# EAGLE design LED-single-sided-front (EAGLE 8.2.2)
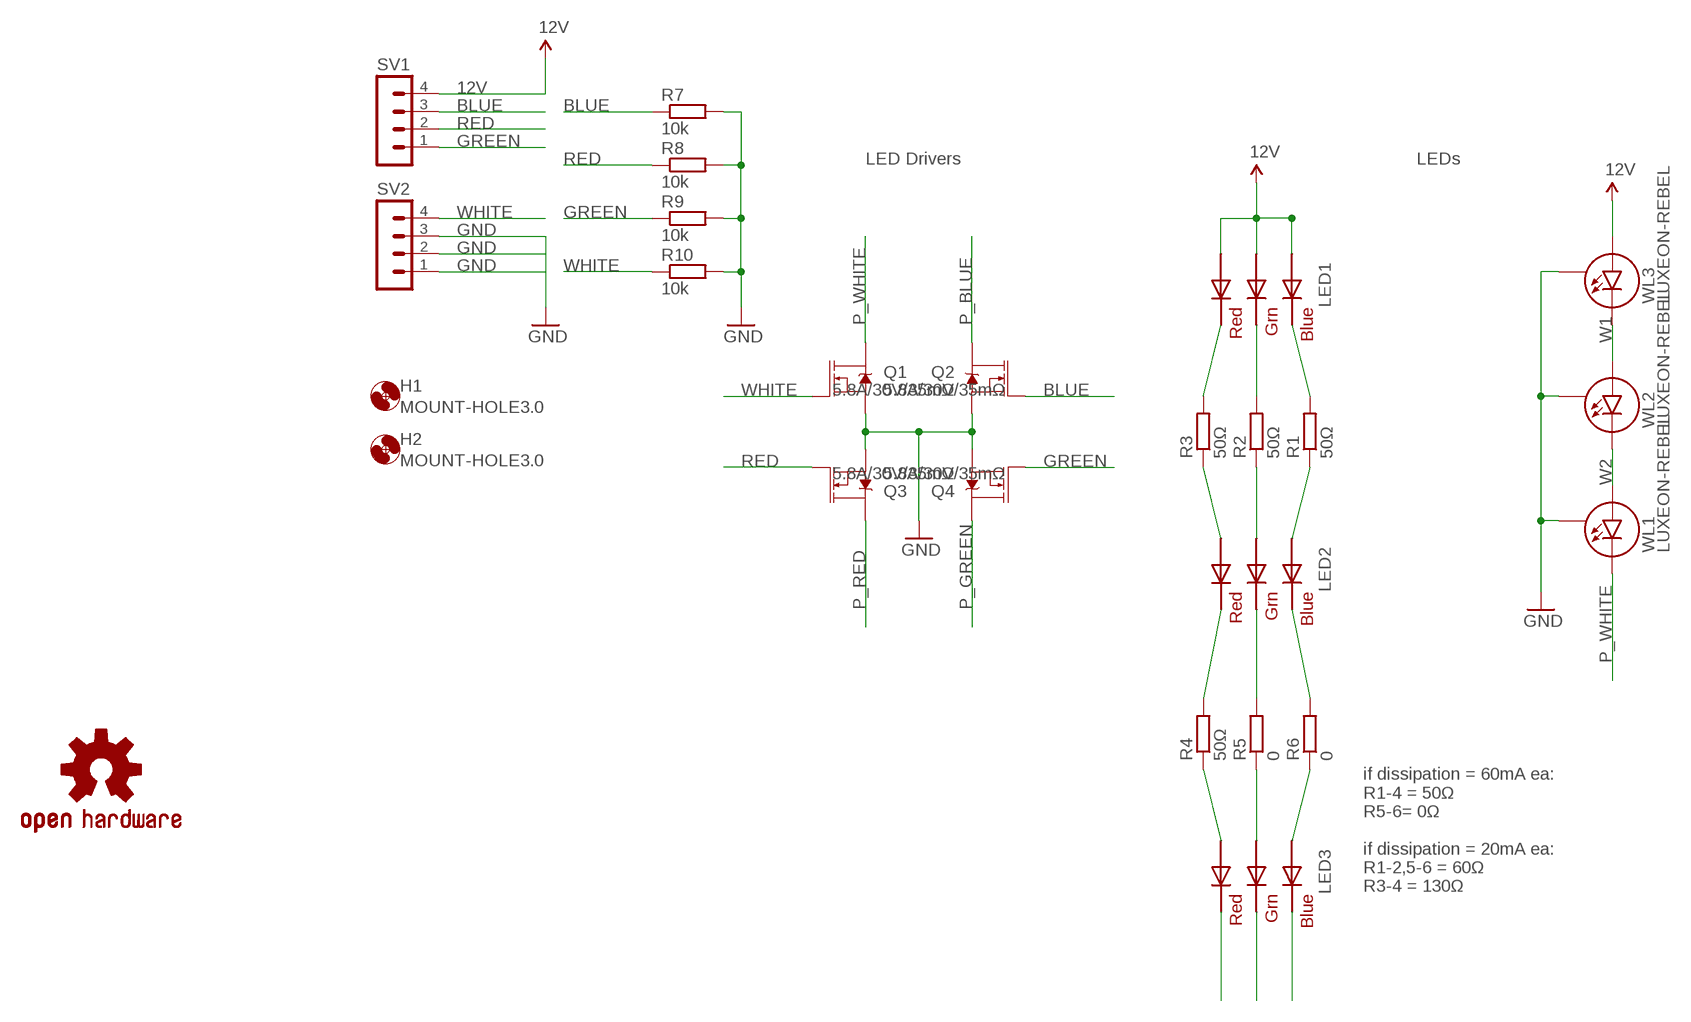
[diagram p0: schematic, sheet 1]

## Parts
H1  MOUNT-HOLE3.0  [3,0]
H2  MOUNT-HOLE3.0  [3,0]
LED1  RGBLED5050  [RGBLED5050]
LED2  RGBLED5050  [RGBLED5050]
LED3  RGBLED5050  [RGBLED5050]
LOGO1  OSHW-LOGOS  [OSHW-LOGO-S]
Q1  5.8A/30V/35mΩ  MOSFET-NCH-AO3404A  [SOT23-3]
Q2  5.8A/30V/35mΩ  MOSFET-NCH-AO3404A  [SOT23-3]
Q3  5.8A/30V/35mΩ  MOSFET-NCH-AO3404A  [SOT23-3]
Q4  5.8A/30V/35mΩ  MOSFET-NCH-AO3404A  [SOT23-3]
R1  50Ω  R-EU_R1206  [R1206]
R2  50Ω  R-EU_R1206  [R1206]
R3  50Ω  R-EU_R1206  [R1206]
R4  50Ω  R-EU_R1206  [R1206]
R5  0  R-EU_R1206  [R1206]
R6  0  R-EU_R1206  [R1206]
R7  10k  R-EU_R1206  [R1206]
R8  10k  R-EU_R1206  [R1206]
R9  10k  R-EU_R1206  [R1206]
R10  10k  R-EU_R1206  [R1206]
SV1  MA04-1  [MA04-1]
SV2  MA04-1  [MA04-1]
WL1  LUXEON-REBEL  [LUXEON-REBEL]
WL2  LUXEON-REBEL  [LUXEON-REBEL]
WL3  LUXEON-REBEL  [LUXEON-REBEL]

## Nets
12V: LED1.1(GREEN_A) LED1.2(RED_A) LED1.3(BLUE_A) SV1.4 WL3.ANODE(A)
BLUE: Q2.1(G) R7.1 SV1.3
GND: Q1.2(S) Q2.2(S) Q3.2(S) Q4.2(S) R7.2 R8.2 R9.2 R10.2 SV2.1 SV2.2 SV2.3 WL1.P$3(S) WL2.P$3(S) WL3.P$3(S)
GREEN: Q4.1(G) R9.1 SV1.1
N$1: LED1.5(RED_C) R3.2
N$2: LED1.6(GREEN_C) R2.2
N$3: LED1.4(BLUE_C) R1.2
N$4: LED3.2(RED_A) R4.1
N$5: LED3.1(GREEN_A) R5.1
N$6: LED3.3(BLUE_A) R6.1
N$30: LED2.5(RED_C) R4.2
N$31: LED2.6(GREEN_C) R5.2
N$32: LED2.4(BLUE_C) R6.2
N$33: LED2.2(RED_A) R3.1
N$34: LED2.1(GREEN_A) R2.1
N$35: LED2.3(BLUE_A) R1.1
P_BLUE: LED3.4(BLUE_C) Q2.3(D)
P_GREEN: LED3.6(GREEN_C) Q4.3(D)
P_RED: LED3.5(RED_C) Q3.3(D)
P_WHITE: Q1.3(D) WL1.CATHODE(C)
RED: Q3.1(G) R8.1 SV1.2
W1: WL2.ANODE(A) WL3.CATHODE(C)
W2: WL1.ANODE(A) WL2.CATHODE(C)
WHITE: Q1.1(G) R10.1 SV2.4

## Notes on the sheet
- LED Drivers | LEDs
- if dissipation = 60mA ea:
  R1-4 = 50Ω
  R5-6= 0Ω
  
  if dissipation = 20mA ea:
  R1-2,5-6 = 60Ω
  R3-4 = 130Ω

## Library data of the parts
H1 H2 = holes:MOUNT-HOLE: MOUNTING HOLE with drill center marker
LED1-LED3 = adafruit:RGBLED: For 5050 RGB LEDs, the order of the LEDs may vary from one manufacturer to another!
LOGO1 = SparkFun-Aesthetics:OSHW-LOGO: Open Source Hardware Logo This logo indicates the piece of hardware it is found on incorporates a OSHW license and/or adheres to the definition of open source hardware found here: http://freedomdefined.org/OSHW
Q1-Q4 = SparkFun-DiscreteSemi:MOSFET-NCH: N-channel MOSFETs Voltage controlled devices that allow control of high current outputs. SparkFun Products: SparkFun OpenScale <https://www.sparkfun.com/products/13261> SparkFun Digital Sandbox <https://www.sparkfun.com/products/12651> SparkFun Monster Moto Shield <https://www.sparkfun.com/products/10182> SparkFun MOSFET Power Controller <https://www.sparkfun.com/products/11214>; PROD_ID: TRANS-12988
R1-R10 = rcl:R-EU_: RESISTOR, European symbol
SV1 SV2 = con-lstb:MA04-1: PIN HEADER; OC_FARNELL: unknown; OC_NEWARK: unknown
WL1-WL3 = SparkFun-LED:LUXEON-REBEL: Luxeon Rebel single-color high output LED

## Board
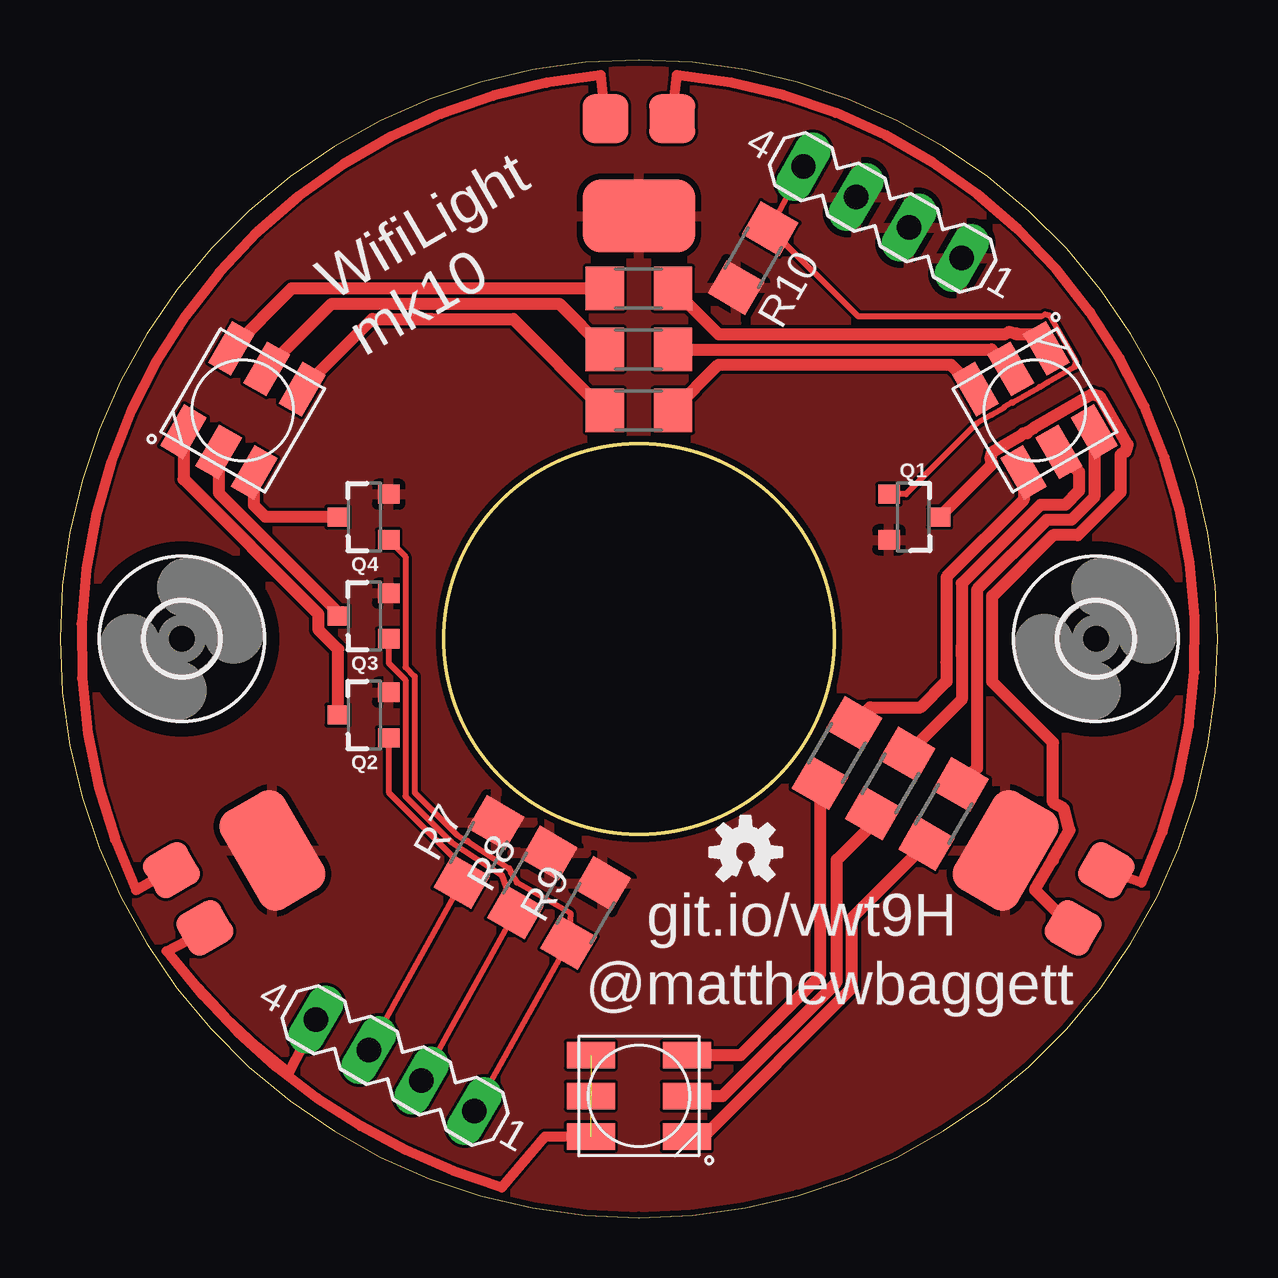
[diagram p1: board, top side]

Size 48.26 x 48.26 mm. Coordinates in mm from the lower left corner, seen from the top.
Outline: 24.13,0 arc90 48.26,24.13 arc90 24.13,48.26 arc90 0,24.13 arc90 24.13,0
Outline: circle at 24.13,24.13 radius 8.13
Copper layers (1*16): Top 0.035mm / dielectric 1.5mm / Bottom 0.035mm
Design rules "dirtypcbs": minimum track width 5mil, minimum drill 12mil, track to track 5mil, track to pad 5mil, pad to pad 5mil, via to via 5mil, smd to smd 0mil, copper to edge 10mil, drill to drill 10mil, minimum pad ring 10mil, minimum via ring 6mil, stop-mask expansion 2mil, vias tented up to drill 25mil, thermal gap 10mil

### Footprints (pad centres in the part's own frame; a part is rotated, then mirrored left to right if it is on the bottom)
3,0 = hole 3: 0,0
RGBLED5050 = smd 2 x 1.1: 1 -2,1.7; 2 -2,0; 3 -2,-1.7; 4 2,-1.7; 5 2,0; 6 2,1.7
SOT23-3 = smd 0.8 x 0.9: 1 -0.95,-1; 2 0.95,-1; 3 0,1.1
R1206 = smd 1.6 x 1.803: 1 -1.422,0; 2 1.422,0
MA04-1 = drill 1.016 long: 1 -3.81,0; 2 -1.27,0; 3 1.27,0; 4 3.81,0
LUXEON-REBEL = smd 1.91 x 2.03: ANODE -1.39,2.63; CATHODE 1.39,2.63 | smd 4.68 x 3.03: P$3 0,-1.42

### Placement (x,y rotation side)
H1  43.18,24.13 0 top
H2  5.08,24.13 0 top
LED1  24.13,5.08 0 top
LED2  40.64,33.66 120 top
LED3  7.62,33.66 240 top
LOGO1  28.57,15.24 0 top
Q1  35.56,29.21 270 top
Q2  12.7,20.95 90 top
Q3  12.7,25.08 90 top
Q4  12.7,29.21 90 top
R1  36.83,16.83 240 top
R2  32.38,19.37 240 top
R3  34.61,18.1 240 top
R4  24.13,36.2 0 top
R5  24.13,33.66 0 top
R6  24.13,38.73 0 top
R7  17.46,15.24 60 top
R8  19.68,13.97 60 top
R9  21.91,12.7 60 top
R10  28.89,40.01 240 top
SV1  13.97,6.35 150 top
SV2  34.29,41.91 150 top
WL1  40.64,14.61 240 top
WL2  24.13,43.18 0 top
WL3  7.62,14.61 120 top

### Tracks (layer width: path | path; a pad name or v marks a point on that pad's centre or on a via)
12V  (2 unrouted)
  Top 0.406: 4.6,10.95 4.45,11.11 5.71,11.76 WL3.ANODE | LED1.3 20.21,3.38 18.41,1.27 arc-37 4.6,10.95 | SV1.4 9.53,6.03 arc-15 4.6,10.95
BLUE
  Top 0.254: Q2.1 13.7,17.73 16.51,14.92 16.51,14.25 R7.1 SV1.3
GND
  pour Top: 0,24.13 arc90 24.13,0 arc90 48.26,24.13 arc90 24.13,48.26 arc90
GREEN
  Top 0.254: Q4.1 14.4,27.56 14.4,22.95 14.79,22.57 14.79,17.73 16.55,15.96 16.93,15.71 16.99,15.71 17.04,15.66 18.72,14.56 18.73,14.54 18.76,14.52 18.78,14.39 19.05,13.97 21.27,12.7 R9.1 SV1.1
N$1
  Top 0.508: LED1.5 27.62,5.08 32.38,9.84 32.38,14.92 33.9,16.43 R3.2
N$2
  Top 0.508: LED1.6 28.37,6.78 31.67,10.08 R2.2
N$3
  Top 0.508: LED1.4 26.82,3.38 33.02,9.58 33.02,12.5 R1.2
N$4
  Top 0.508: R4.1 20.8,38.1 11.33,38.1 LED3.2
N$5
  Top 0.508: R5.1 18.9,37.47 15.5,37.47 | 15.5,37.47 15.24,37.47 | LED3.1 13.02,37.47 15.5,37.47
N$6
  Top 0.508: R6.1 9.65,38.73 LED3.3
N$30
  Top 0.508: R4.2 38.83,36.2 LED2.5
N$31
  Top 0.508: R5.2 27.46,35.56 37.15,35.56 LED2.6
N$32
  Top 0.508: R6.2 27.46,36.83 39.38,36.83 39.56,36.94 39.87,36.85 39.88,36.83 40.52,36.83 LED2.4
N$33
  Top 0.508: R3.1 37.59,21.6 37.59,23.44 | 37.59,23.44 37.59,23.81 | LED2.2 42.48,31.09 42.48,30.3 41.89,29.72 40.87,29.72 37.59,26.45 37.59,23.44
N$34
  Top 0.508: R2.1 33.77,21.27 35.88,21.27 36.96,22.35 36.96,23.12 | 36.96,23.12 36.96,23.18 | LED2.1 40.17,29.92 36.96,26.71 36.96,23.18 | 36.96,23.18 36.96,23.12
N$35
  Top 0.508: R1.1 38.23,18.75 38.23,26.18 41.13,29.08 42.16,29.08 43.11,30.04 LED2.3
P_BLUE
  Top 0.508: Q2.3 11.6,23.69 10.77,24.52 10.77,25.16 5.15,30.78 LED3.4
P_GREEN
  Top 0.508: LED3.6 8.09,29.69 8.57,29.21 Q4.3
P_RED
  Top 0.508: Q3.3 11.6,25.23 6.62,30.21 LED3.5
P_WHITE
  Top 0.508: Q1.3 38.88,31.43 38.78,31.61 38.86,31.91 40.05,32.6 40.15,32.7 40.32,32.7 40.34,32.77 40.58,32.91 43.03,34.32 43.34,34.24 44.2,32.74 | 44.2,32.74 | 44.2,32.74 44.5,32.24 44.42,31.93 44.2,31.81 44.2,30.23 42.42,28.45 41.39,28.45 38.86,25.92 38.86,22.34 41.39,19.81 41.39,17.31 41.84,17.06 42.08,16.15 41.39,14.96 41.39,14.91 41.33,14.84 40.65,13.66 WL1.CATHODE
RED
  Top 0.254: Q3.1 13.7,23.11 14.4,22.41 14.4,17.57 16.3,15.67 18.41,14.29 R8.1 SV1.2
W1
  Top 0.406: WL2.ANODE 22.54,47.62 arc110 3.17,13.65 WL3.CATHODE
W2
  Top 0.406: WL1.ANODE 45.09,13.97 arc110 25.72,47.62 WL2.CATHODE
WHITE
  Top 0.254: SV2.4 R10.1 33.28,37.56 40.9,37.56 41.05,37.65 41.26,37.6 42.36,35.68 42.32,35.53 42.31,35.48 41.17,34.82 41.16,34.83 40.83,34.63 39.7,33.97 39.66,33.98 39.37,33.8 39.36,33.78 38.84,33.48 | 38.84,33.48 38.23,33.12 35.26,30.16 Q1.1 | 38.84,33.48

### Text on the board
tNames: WifiLight / mk10 | git.io/vwt9H | @matthewbaggett